# EAGLE design DigiPot (EAGLE 5.11)
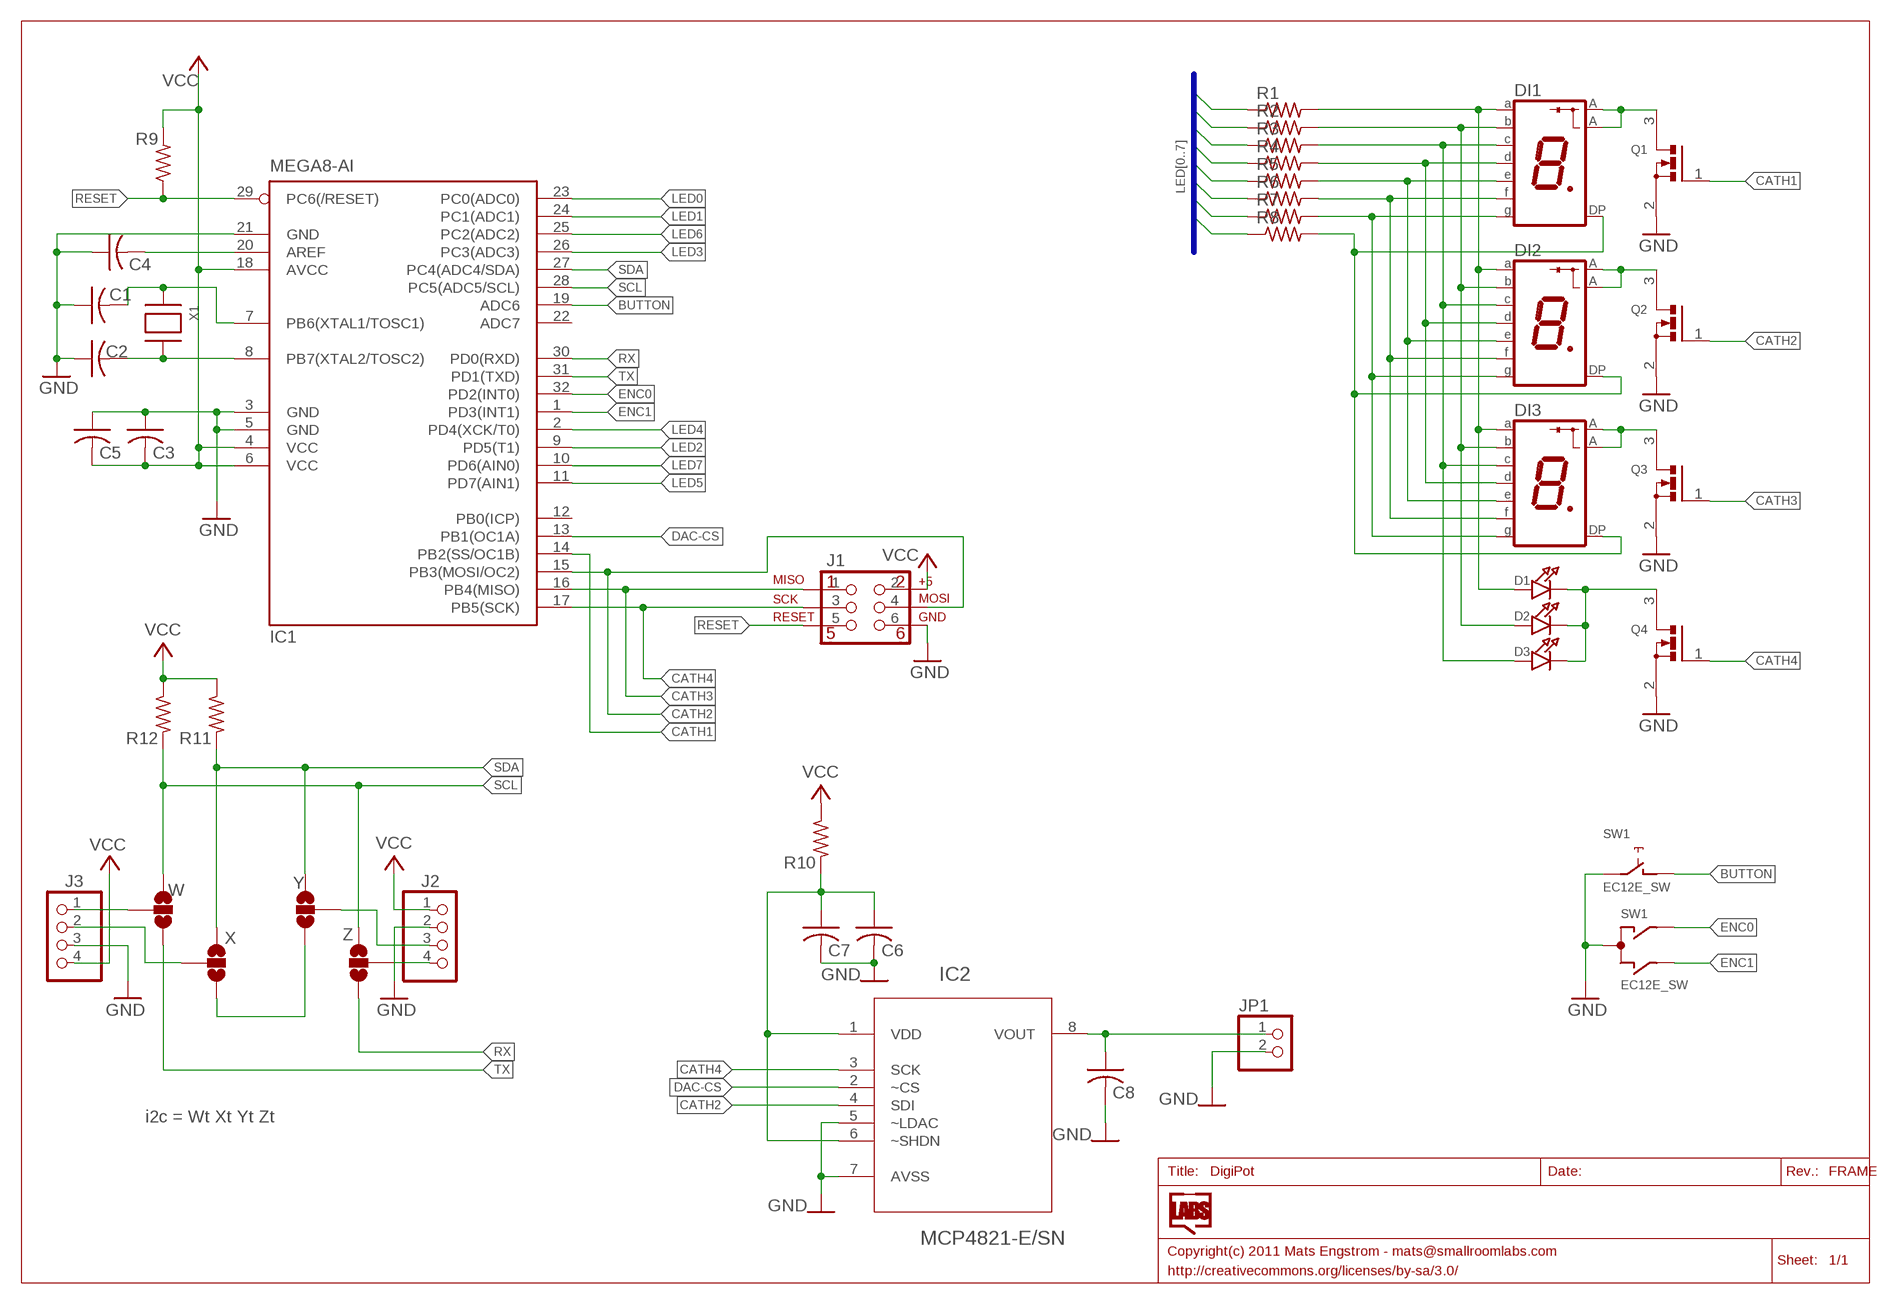
[diagram p0: schematic, sheet 1]

## Parts
C1  C-USC0805K  [C0805K]
C2  C-USC0805K  [C0805K]
C3  C-USC0805K  [C0805K]
C4  C-USC0805K  [C0805K]
C5  C-USC0805K  [C0805K]
C6  C-USC0805K  [C0805K]
C7  C-USC0805K  [C0805K]
C8  C-USC0805K  [C0805K]
D1  LEDSMD0805  [CHIPLED_0805]
D2  LEDSMD0805  [CHIPLED_0805]
D3  LEDSMD0805  [CHIPLED_0805]
DI1  7SEG-CA0.3"SMD  [KCSA03]
DI2  7SEG-CA0.3"SMD  [KCSA03]
DI3  7SEG-CA0.3"SMD  [KCSA03]
IC1  MEGA8-AI  [TQFP32-08]
IC2  MCP4821-E/SN  [SOIC8-N_MC]
J1  AVR-ISP6_EDGE  [ISP-EDGE]
J2  HEADER1X0490OCT  [1X04/90_OCT]
J3  HEADER1X0490OCT  [1X04/90_OCT]
JP1  PINHD-1X2/90  [1X02/90]
Q1  MOSFET-NWAVE  [SOT23-W]
Q2  MOSFET-NWAVE  [SOT23-W]
Q3  MOSFET-NWAVE  [SOT23-W]
Q4  MOSFET-NWAVE  [SOT23-W]
R1  RES0805A  [R0805A]
R2  RES0805A  [R0805A]
R3  RES0805A  [R0805A]
R4  RES0805A  [R0805A]
R5  RES0805A  [R0805A]
R6  RES0805A  [R0805A]
R7  RES0805A  [R0805A]
R8  RES0805A  [R0805A]
R9  RES0805A  [R0805A]
R10  RES0805A  [R0805A]
R11  RES0805A  [R0805A]
R12  RES0805A  [R0805A]
SW1  EC12E_SW  [ALPS_EC12E_SW]
W  SOLDERJUMPER_2WAYS  [SJ_3]
X  SOLDERJUMPER_2WAYS  [SJ_3]
X1  XTALNX5032  [NX5032]
Y  SOLDERJUMPER_2WAYS  [SJ_3]
Z  SOLDERJUMPER_2WAYS  [SJ_3]

## Nets
BUTTON: IC1.19(ADC6) SW1.D
CA1: DI1.P$3(A) DI1.P$8(A) Q1.3(D)
CA2: DI2.P$3(A) DI2.P$8(A) Q2.3(D)
CA3: DI3.P$3(A) DI3.P$8(A) Q3.3(D)
CA4: D1.C D2.C D3.C Q4.3(D)
CATH1: IC1.14(PB2(SS/OC1B)) Q1.1(G)
CATH2: IC1.15(PB3(MOSI/OC2)) IC2.4(SDI) J1.4(MOSI) Q2.1(G)
CATH3: IC1.16(PB4(MISO)) J1.1(MISO) Q3.1(G)
CATH4: IC1.17(PB5(SCK)) IC2.3(SCK) J1.3(SCK) Q4.1(G)
DAC-CS: IC1.13(PB1(OC1A)) IC2.2(~CS)
ENC0: IC1.32(PD2(INT0)) SW1.A
ENC1: IC1.1(PD3(INT1)) SW1.B
GND: C1.1 C2.1 C3.1 C4.1 C5.1 C6.2 C7.2 C8.2 IC1.3(GND) IC1.5(GND) IC1.21(GND) IC2.5(~LDAC) IC2.7(AVSS) J1.6(GND) J2.2 J3.3 JP1.2 Q1.2(S) Q2.2(S) Q3.2(S) Q4.2(S) SW1.C SW1.E
LED0: IC1.23(PC0(ADC0)) R1.1
LED1: IC1.24(PC1(ADC1)) R2.1
LED2: IC1.9(PD5(T1)) R3.1
LED3: IC1.26(PC3(ADC3)) R4.1
LED4: IC1.2(PD4(XCK/T0)) R5.1
LED5: IC1.11(PD7(AIN1)) R6.1
LED6: IC1.25(PC2(ADC2)) R7.1
LED7: IC1.10(PD6(AIN0)) R8.1
LEDA: D1.A DI1.P$7(A) DI2.P$7(A) DI3.P$7(A) R1.2
LEDB: D2.A DI1.P$6(B) DI2.P$6(B) DI3.P$6(B) R2.2
LEDC: D3.A DI1.P$4(C) DI2.P$4(C) DI3.P$4(C) R3.2
LEDD: DI1.P$2(D) DI2.P$2(D) DI3.P$2(D) R4.2
LEDE: DI1.P$1(E) DI2.P$1(E) DI3.P$1(E) R5.2
LEDF: DI1.P$9(F) DI2.P$9(F) DI3.P$9(F) R6.2
LEDG: DI1.P$10(G) DI2.P$10(G) DI3.P$10(G) R7.2
LEDP: DI1.P$5(DP) DI2.P$5(DP) DI3.P$5(DP) R8.2
LEFT-A: J3.1 W.2
LEFT-B: J3.2 X.2
N$1: X.3 Y.1
N$2: C8.1 IC2.8(VOUT) JP1.1
N$3: C6.1 C7.1 IC2.1(VDD) IC2.6(~SHDN) R10.2
N$4: C1.2 IC1.7(PB6(XTAL1/TOSC1)) X1.P$1
N$5: C4.2 IC1.20(AREF)
N$7: C2.2 IC1.8(PB7(XTAL2/TOSC2)) X1.P$2
RESET: IC1.29(PC6(/RESET)) J1.5(RESET) R9.1
RIGHT-A: J2.4 Z.2
RIGHT-B: J2.3 Y.2
RX: IC1.30(PD0(RXD)) Z.1
SCL: IC1.28(PC5(ADC5/SCL)) R12.2 W.1 Z.3
SDA: IC1.27(PC4(ADC4/SDA)) R11.2 X.1 Y.3
TX: IC1.31(PD1(TXD)) W.3
VCC: C3.2 C5.2 IC1.4(VCC) IC1.6(VCC) IC1.18(AVCC) J1.2(V+) J2.1 J3.4 R9.2 R10.1 R11.1 R12.1
Unconnected: IC1.12(PB0(ICP)) IC1.22(ADC7) SW1.GND1(G) SW1.GND2(G)

## Buses
LED[0..7]

## Notes on the sheet
- i2c = Wt Xt Yt Zt

## Library data of the parts
C1-C8 = resistor:C-US: CAPACITOR, American symbol
D1-D3 = SmallRoomLabs:LED
DI1-DI3 = SmallRoomLabs:7SEG-CA
IC1 = atmel:MEGA8: MICROCONTROLLER 8 Kbytes FLASH, 1 kbytes SRAM, 512 bytes EEPROM, USART, 6-channel 10 bit ADC, 2-channel 8 bit ADC Pin compatible with Atmega48, ATMega88, ATMega168 Source: avr.lbr; MPN: ATMEGA8-16AU; OC_FARNELL: 9171371; OC_NEWARK: 73M8863
IC2 = SmallRoomLabs:MCP4821-E/SN: 12 Bit DAC; DESCRIPTION: 12 Bit DAC; MPN: MCP4821-E/SN; OC_FARNELL: 1439412; OC_NEWARK: 31K2970; PACKAGE: SOIC-8; SUPPLIER: Microchip
J1 = SmallRoomLabs:AVR-ISP6
J2 J3 = SmallRoomLabs:HEADER1X04
JP1 = pinhead:PINHD-1X2: PIN HEADER
Q1-Q4 = microbuilder:MOSFET-N: N-Channel Mosfet Digikey: 2N7002ET1GOSTR-ND
R1-R12 = SmallRoomLabs:RES
SW1 = switch-alps:EC12E_SW: ALPS rotary Encoder EC12E series with switch; MPN: EC12E2424407; OC_FARNELL: 1520813; OC_NEWARK: 74M1068
W X Y Z = SparkFun:SOLDERJUMPER_2WAY: Solder Jumper 2 way solder jumper
X1 = adafruit:XTAL: Low cost SMT crystals, no capacitors included http://www.ladyada.net/library/eagle

## Net classes
0 default: width 0.203 mm, clearance 0.203 mm

## Board
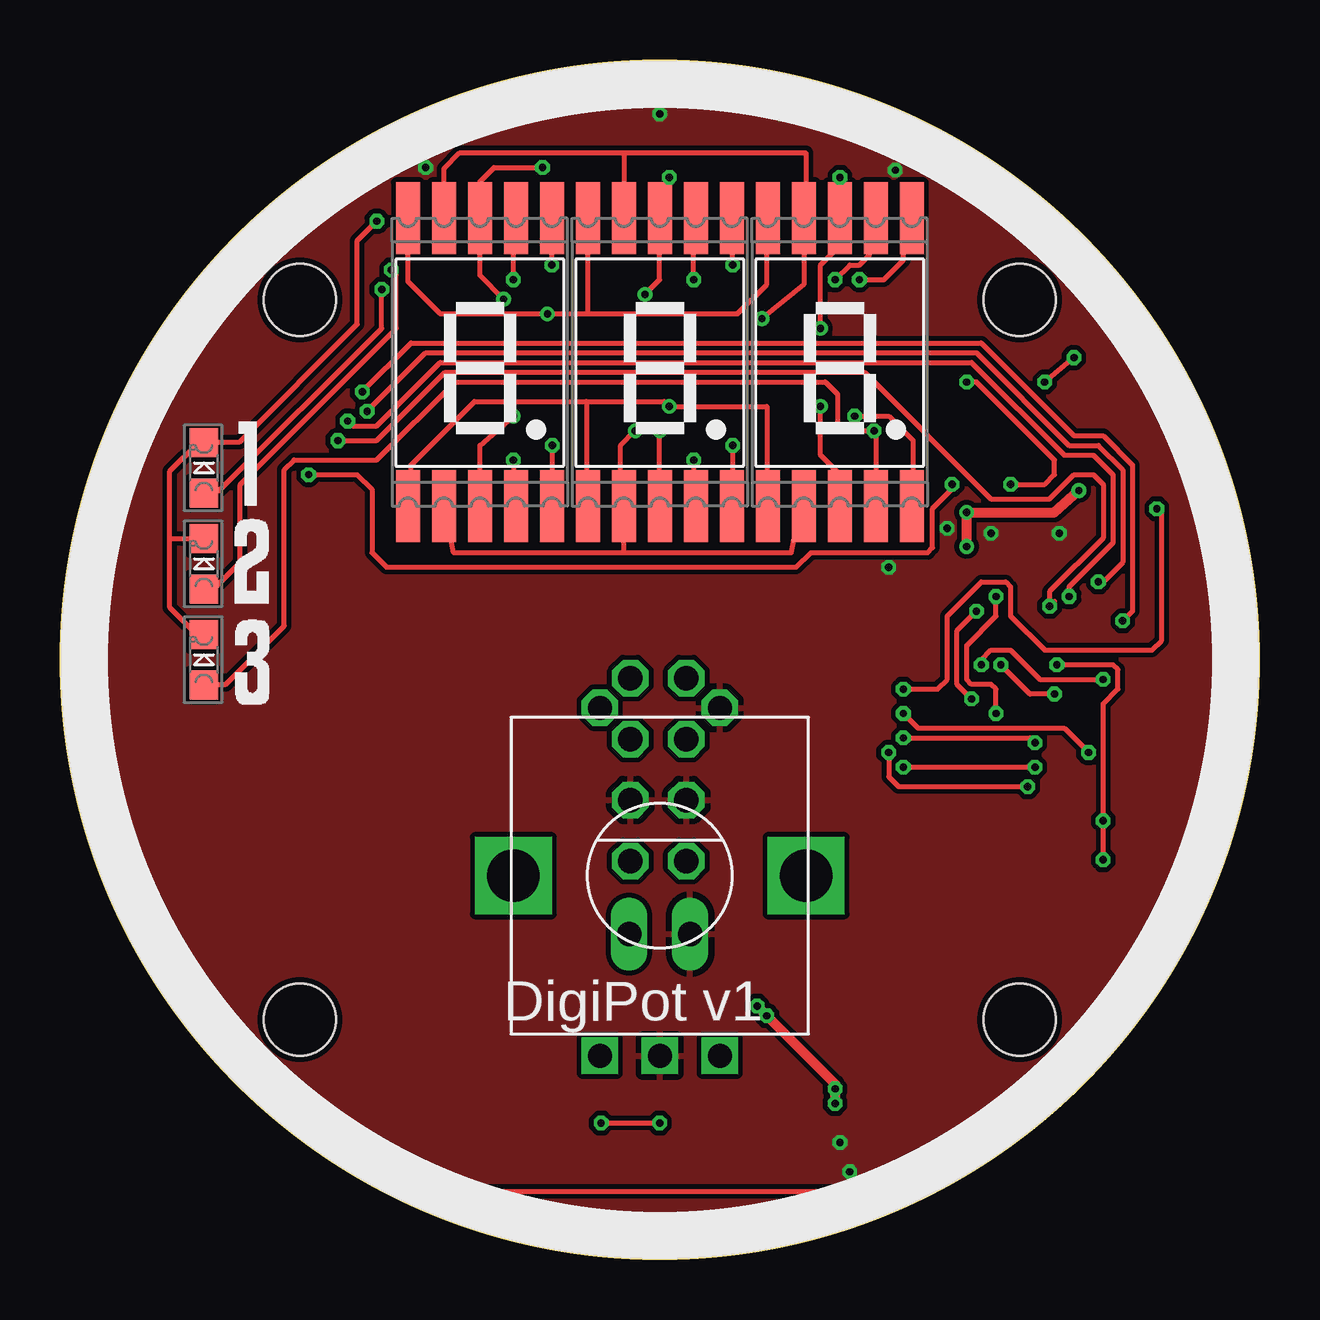
[diagram p1: board, top side]
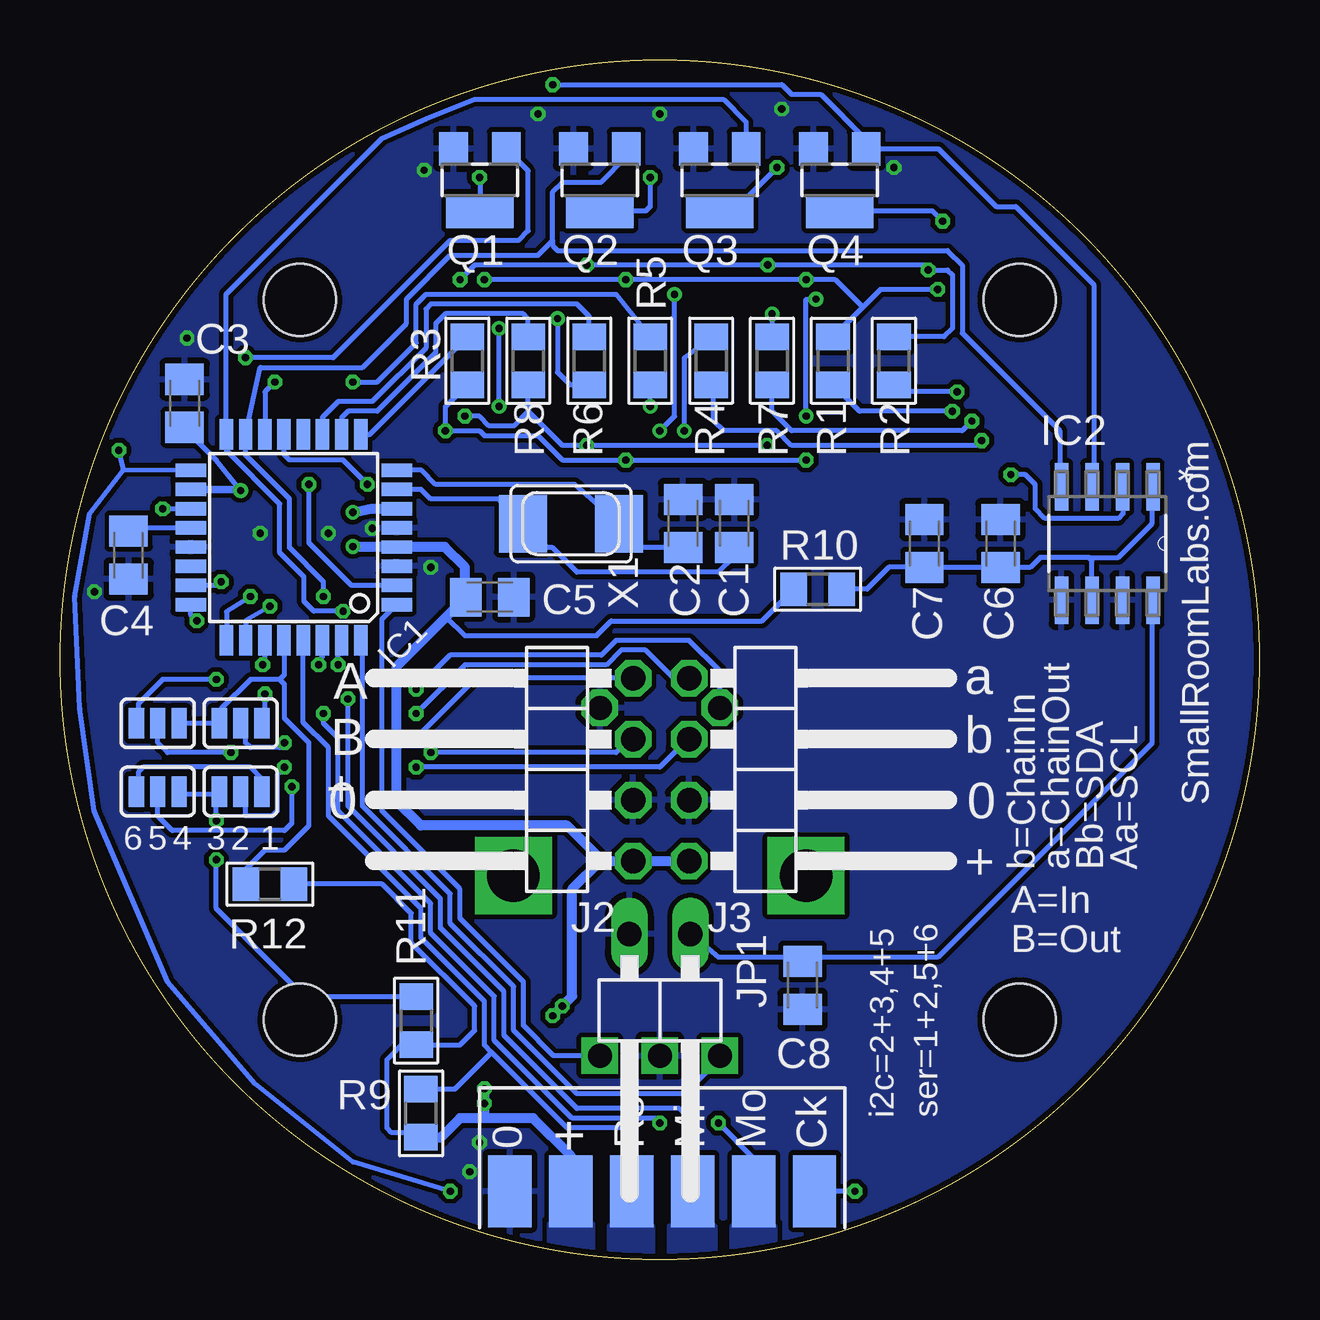
[diagram p2: board, bottom side, seen from below]

Size 50 x 50 mm. Coordinates in mm from the lower left corner, seen from the top.
Outline: circle at 25,25 radius 25
Copper layers (1*16): Top 0.035mm / dielectric 1.5mm / Bottom 0.035mm
Design rules "Fusion_eagle_rule_v1.1": minimum track width 6mil, minimum drill 12mil, track to track 6mil, track to pad 6mil, pad to pad 6mil, via to via 6mil, smd to smd 0mil, copper to edge 10mil, drill to drill 10mil, minimum pad ring 10mil, minimum via ring 6mil, stop-mask expansion 2mil, vias tented up to drill 100mil, thermal gap 10mil
Holes 3 mm at 10,40 40,40 40,10 10,10

### Footprints (pad centres in the part's own frame; a part is rotated, then mirrored left to right if it is on the bottom)
C0805K = smd 1.3 x 1.6: 1 -1,0; 2 1,0
CHIPLED_0805 = smd 1.2 x 1.2: A 0,-1.05; C 0,1.05
KCSA03 = smd 1 x 3: P$1 -3,-6; P$2 -1.5,-6; P$3 0,-6; P$4 1.5,-6; P$5 3,-6; P$6 3,6; P$7 1.5,6; P$8 0,6; P$9 -1.5,6; P$10 -3,6
TQFP32-08 = smd 1.27 x 0.559: 1 -4.293,2.8; 2 -4.293,2; 3 -4.293,1.2; 4 -4.293,0.4; 5 -4.293,-0.4; 6 -4.293,-1.2; 7 -4.293,-2; 8 -4.293,-2.8; 17 4.293,-2.8; 18 4.293,-2; 19 4.293,-1.2; 20 4.293,-0.4; 21 4.293,0.4; 22 4.293,1.2; 23 4.293,2; 24 4.293,2.8 | smd 0.559 x 1.27: 9 -2.8,-4.293; 10 -2,-4.293; 11 -1.2,-4.293; 12 -0.4,-4.293; 13 0.4,-4.293; 14 1.2,-4.293; 15 2,-4.293; 16 2.8,-4.293; 25 2.8,4.293; 26 2,4.293; 27 1.2,4.293; 28 0.4,4.293; 29 -0.4,4.293; 30 -1.2,4.293; 31 -2,4.293; 32 -2.8,4.293
SOIC8-N_MC = smd 1.981 x 0.559: 1 -2.362,1.905; 2 -2.362,0.635; 3 -2.362,-0.635; 4 -2.362,-1.905; 5 2.362,-1.905; 6 2.362,-0.635; 7 2.362,0.635; 8 2.362,1.905
ISP-EDGE = smd 1.8 x 3: 1 1.27,0; 2 -3.81,0; 3 6.35,0; 4 3.81,0; 5 -1.27,0; 6 -6.35,0
1X04/90_OCT = drill 1.016 octagon: 1 0,3.81; 2 0,1.27; 3 0,-1.27; 4 0,-3.81
1X02/90 = drill 1.016 long: 1 -1.27,-3.81; 2 1.27,-3.81
SOT23-W = smd 1.2 x 1.4: 1 -1.1,-1.3; 2 1.1,-1.3 | smd 2.8 x 1.4: 3 0,1.3
R0805A = smd 1.1 x 1.4: 1 -1,0; 2 1,0
ALPS_EC12E_SW = drill 1 square: A -2.5,-7.5; B 2.5,-7.5; C 0,-7.5 | drill 1 octagon: D -2.5,7; E 2.5,7 | drill 2.2 square: GND1 -6.1,0; GND2 6.1,0
SJ_3 = smd 0.635 x 1.27: 1 -0.889,0; 2 0,0; 3 0.889,0
NX5032 = smd 2 x 2.4: P$1 2,0; P$2 -2,0

### Placement (x,y rotation side)
C1  21.89,30.68 270 bottom
C2  24.03,30.68 270 bottom
C3  44.81,35.69 270 bottom
C4  47.14,29.36 90 bottom
C5  32.08,27.61 180 bottom
C6  10.79,29.84 90 bottom
C7  13.97,29.84 90 bottom
C8  19.05,11.43 270 bottom
D1  6,33 0 top
D2  6,29 0 top
D3  6,25 0 top
DI1  32.5,37.4 0 top
DI2  25,37.4 0 top
DI3  17.5,37.4 0 top
IC1  40.26,30.1 180 bottom
IC2  6.35,29.84 270 bottom
J1  24.9,2.85 0 bottom
J2  26.11,20.42 180 bottom
J3  23.77,20.42 0 bottom
JP1  24.99,9.75 180 bottom
Q1  32.5,45 180 bottom
Q2  27.5,45 180 bottom
Q3  22.5,45 180 bottom
Q4  17.5,45 180 bottom
R1  17.78,37.47 90 bottom
R2  15.24,37.47 90 bottom
R3  33.02,37.47 270 bottom
R4  22.86,37.47 90 bottom
R5  25.4,37.47 270 bottom
R6  27.94,37.47 270 bottom
R7  20.32,37.47 90 bottom
R8  30.48,37.47 270 bottom
R9  34.95,6.1 270 bottom
R10  18.41,27.94 0 bottom
R11  35.15,9.96 90 bottom
R12  41.25,15.65 180 bottom
SW1  25,16 0 top
W  45.92,22.35 180 bottom
X  42.47,19.51 0 bottom
X1  28.7,30.67 180 bottom
Y  45.92,19.51 0 bottom
Z  42.47,22.35 180 bottom

### Tracks (layer width: path | path; a pad name or v marks a point on that pad's centre or on a via)
BUTTON  (via drill 0.3)
  Top 0.203: v35.15,23.77 36.58,23.77 36.98,24.18 36.98,26.82 38.41,28.25 39.42,28.25 39.62,28.04 39.62,26.82 41.05,25.4 45.52,25.4 45.92,25.81 45.92,31.09 v45.72,31.29
  Bottom 0.203: SW1.D 22.5,24.53 23.77,25.81 26.82,25.81 27.43,25.2 33.73,25.2 v35.15,23.77 | v45.72,31.29 IC1.19
CA1  (via drill 0.3)
  Top 0.203: v32.51,45.11 32.51,43.4 DI1.P$8 32.51,43.39 32.51,42.27 31.7,41.45 v31.7,38.81 | DI1.P$3 32.5,32.73 31.7,33.53 v31.7,35.56
  Bottom 0.203: v32.51,45.11 v32.5,45.11 Q1.3 | v31.7,35.56 v31.7,38.81
CA2  (via drill 0.3)
  Top 0.203: v25.4,45.11 25.41,43.48 DI2.P$8 24.99,40.84 v24.38,40.23 | DI2.P$3 v24.99,34.54
  Bottom 0.203: v24.99,34.54 24.38,35.15 v24.38,40.23 | Q2.3 25.59,43.7 25.4,43.89 v25.4,45.11
CA3  (via drill 0.3)
  Top 0.203: DI3.P$3 17.5,33.93 v18.9,35.15 | v18.49,40.03 17.5,41.02 DI3.P$8 17.5,44.93 18.09,45.52 v20.12,45.52
  Bottom 0.203: 22.35,43.69 Q3.3 21.93,43.7 v20.12,45.52 | v18.9,35.15 18.9,40.03 v18.49,40.03
CA4  (via drill 0.3)
  Top 0.203: v13.21,43.28 12.39,42.47 12.39,38.99 7.48,34.08 6.03,34.08 D1.C 5.77,34.05 4.58,32.86 4.58,30.07 | 4.58,30.07 4.58,27.17 5.6,26.15 5.9,26.15 D3.C | D2.C 4.6,30.05 4.58,30.07
  Bottom 0.203: v13.21,43.28 13.63,43.7 Q4.3
CATH1  (via drill 0.3)
  Top 0.203: v42.27,37.59 v41.05,36.58
  Bottom 0.203: Q1.1 30.48,45.38 30.48,42.88 30.89,42.47 33.73,42.47 38.61,37.59 v42.27,37.59 | v41.05,36.58 41.45,36.17 IC1.14
CATH2  (via drill 0.3)
  Top 0.203: v39.01,27.64 39.01,26.82 37.8,25.6 37.8,24.18 38,23.98 38.81,23.98 39.01,23.77 v39.01,22.76 | v22.55,5.69 v24.99,5.69
  Bottom 0.203: IC1.15 | Q2.1 26.4,45.94 27.43,44.91 29.06,44.91 29.46,44.5 29.46,42.47 | 29.46,42.47 30.07,41.86 33.73,41.86 35.56,40.03 35.56,39.01 37.39,37.19 41.66,37.19 IC1.15 | v22.55,5.69 21.09,4.22 J1.4 | v39.01,27.64 39.01,28.25 40.44,29.67 40.44,31.7 42.27,33.53 IC1.15 | v39.01,22.76 39.01,22.35 38.41,21.74 38.41,18.69 34.54,14.83 34.54,13.61 31.9,10.97 31.9,9.14 28.65,5.89 25.2,5.89 v24.99,5.69 | 29.46,42.47 29.46,42.27 29.26,42.06 13.01,42.06 12.39,41.45 12.39,38.61 8.33,34.54 8.33,32.28 IC2.4
  pour Bottom (rank 2, no thermals): 20.2,1.4 20.2,0.4 22,0.4 22,1.4
CATH3  (via drill 0.3)
  Top 0.203: v38,23.37 37.39,23.98 37.39,26.21 v38.2,27.03
  Bottom 0.203: v38,23.37 38,18.9 34.14,15.04 34.14,13.82 31.5,11.18 31.5,9.35 28.45,6.3 24.18,6.3 23.77,5.89 23.77,3 J1.1 | Q3.1 21.4,47.41 22.35,48.36 32.72,48.36 34.75,47.55 36.58,46.74 43.08,40.23 43.08,34.41 IC1.16 43.06,33.71 40.84,31.5 40.84,29.46 39.83,28.45 39.83,27.43 39.42,27.03 v38.2,27.03
  pour Bottom (rank 2, no thermals): 22.7,1.4 22.7,0.1 24.6,0.1 24.6,1.4
CATH4  (via drill 0.3)
  Top 0.203: v29.46,48.97 33.33,48.16 36.58,46.74 38.81,45.31 42.06,42.67 44.91,39.42 46.13,37.59 47.55,34.75 v47.55,33.73 | v16.87,2.85 v33.73,2.85
  Bottom 0.203: 47.35,32.92 48.77,31.09 49.38,27.64 49.17,22.96 48.56,18.69 45.52,11.58 41.86,7.32 37.8,4.06 v33.73,2.85 | 47.35,32.92 IC1.17 | v29.46,48.97 19.91,48.97 19.51,48.56 18.29,48.56 16.4,46.68 Q4.1 13.38,46.3 10.97,43.89 10.16,43.89 6.91,40.64 6.91,32.28 IC2.3 | 47.35,32.92 v47.55,33.73 | v16.87,2.85 J1.3
DAC-CS  (via drill 0.3)
  Top 0.203: v37.19,32.31 37.19,32.11 36.37,31.29 36.37,29.67 36.17,29.46 31.29,29.46 30.68,28.85 13.61,28.85 13.01,29.46 13.01,32.11 12.39,32.72 v10.36,32.72
  Bottom 0.203: IC1.13 40.66,33.55 40.44,33.33 38.2,33.33 v37.19,32.31 | v10.36,32.72 9.75,32.72 9.35,32.31 9.35,31.29 8.94,30.89 5.89,30.89 5.69,31.09 5.69,32.18 IC2.2
ENC0
  Bottom 0.203: SW1.A 22.5,8.39 23.98,6.91 28.45,6.91 31.09,9.55 31.09,11.38 33.73,14.02 33.73,15.24 37.39,18.9 37.39,25.74 IC1.32
ENC1
  Bottom 0.203: SW1.B 29.43,8.5 30.68,9.75 30.68,11.58 33.33,14.22 33.33,15.44 36.58,18.69 36.58,26.69 IC1.1
GND  (via drill 0.3)
  other vias: 48.56,27.84 44.7,38.4 36.98,30.48 34.54,28.85 30.07,47.75 24.99,47.75 19.91,47.96 34.82,45.41 15.24,45.52 32.51,4.88 32.92,3.66 38.81,30.28 41.66,30.28
  pour Bottom (rank 5): 0,25 arc-90 25,50 arc-90 50,25 arc-90 25,0 arc-90
  pour Top: 0,25 arc-90 25,50 arc-90 50,25 arc-90 25,0 arc-90
LED0  (via drill 0.3)
  Top 0.203: v43.28,28.25 43.48,28.25 44.3,29.06 44.3,32.92 43.28,33.93 42.06,33.93 38.2,37.8 15.24,37.8 v12.8,35.36
  Bottom 0.203: 17.68,36.36 R1.1 16.67,35.36 v12.8,35.36 | IC1.23 43.43,28.1 v43.28,28.25
LED1  (via drill 0.3)
  Top 0.203: v12.6,36.17 14.63,38.2 38.41,38.2 42.27,34.34 43.48,34.34 44.7,33.12 44.7,27.03 v44.3,26.62
  Bottom 0.203: IC1.24 44.55,26.87 v44.3,26.62 | v12.6,36.17 14.95,36.17 R2.1
LED2
  Bottom 0.203: IC1.9 37.09,34.39 R3.1
LED3  (via drill 0.3)
  Top 0.203: 41.45,27.43 v41.25,27.23 41.25,27.84 43.48,30.07 43.48,32.31 43.08,32.72 42.27,32.72 41.25,31.7 38.81,31.7 33.53,36.98 16.05,36.98 13.21,34.14 v11.58,34.14
  Bottom 0.203: R4.1 22.76,36.36 22.76,34.95 22.35,34.54 20.12,34.54 19.51,33.93 11.79,33.93 v11.58,34.14 | IC1.26 42.26,26.63 v41.25,27.23
LED4  (via drill 0.3)
  Top 0.203: v37.8,36.58 38.2,36.58 41.45,33.33 41.45,32.72 41.05,32.31 v39.62,32.31
  Bottom 0.203: R5.1 26.82,40.23 34.75,40.23 35.15,39.83 35.15,38.2 36.78,36.58 v37.8,36.58 | IC1.2 37.85,28.1 39.62,29.87 v39.62,32.31
LED5
  Bottom 0.203: R6.1 27.94,39.32 28.45,39.83 34.54,39.83 34.75,39.62 34.75,38 36.98,35.76 38.41,35.76 39.06,35.11 IC1.11
LED6  (via drill 0.3)
  Top 0.203: v42.06,27.64 42.06,28.04 43.89,29.87 43.89,32.72 43.08,33.53 41.86,33.53 38,37.39 15.85,37.39 13.21,34.75 12.19,34.75 v11.99,34.95
  Bottom 0.203: R7.1 20.32,35.36 19.51,34.54 12.39,34.54 v11.99,34.95 | IC1.25 43.06,27.01 v42.06,27.64
LED7
  Bottom 0.203: R8.1 30.48,39.22 30.68,39.42 33.93,39.42 34.34,39.01 34.34,37.8 36.78,35.36 38,35.36 38.26,35.1 IC1.10
LEDA  (via drill 0.3)
  Top 0.203: DI3.P$7 18.9,43.4 v18.9,40.84 | DI2.P$7 26.42,43.4 v26.42,40.84 | v32.31,40.84 32.92,41.45 33.33,41.45 33.73,41.86 33.73,43.13 DI1.P$7 | v13.41,40.44 13.41,38.81 6.64,32.04 6.09,32.04 D1.A
  Bottom 0.203: v32.31,40.84 v26.42,40.84 v18.9,40.84 17.68,40.84 16.54,39.7 | v13.41,40.44 15.81,40.44 16.54,39.7 | 16.54,39.7 R1.2
LEDB  (via drill 0.3)
  Top 0.203: DI2.P$6 28.04,43.4 v28.04,41.45 | 35.56,43.4 DI1.P$6 35.5,43.22 35.15,42.88 35.15,41.66 34.34,40.84 v33.33,40.84 | v20.5,41.45 DI3.P$6 | D2.A 6.41,27.95 7.52,29.06 7.52,32.31 14.02,38.81 14.02,41.05 v13.82,41.25
  Bottom 0.203: R2.2 13.15,38.47 12.8,38.81 12.8,41.05 13.01,41.25 v13.82,41.25 14.02,41.45 v20.5,41.45 v28.04,41.45 32.72,41.45 v33.33,40.84
LEDC  (via drill 0.3)
  Top 0.203: DI3.P$4 18.9,31.4 v18.9,33.33 | DI2.P$4 26.42,31.4 v26.42,33.33 | DI1.P$4 34,34.48 v33.93,34.54 32.61,34.54 32.41,34.75 32.41,36.07 31.9,36.58 16.46,36.58 13.21,33.33 9.75,33.33 9.35,32.92 9.35,26.42 6.91,23.98 6.03,23.98 D3.A
  Bottom 0.203: v18.9,33.33 v26.42,33.33 29.06,33.33 30.07,34.34 32.31,34.34 32.51,34.54 v33.93,34.54 33.93,35.55 R3.2
LEDD  (via drill 0.3)
  Top 0.203: DI3.P$2 16.41,29.46 23.5,29.46 | 23.5,29.46 30.48,29.46 30.89,31.4 DI1.P$2 | 23.5,29.46 DI2.P$2 23.5,31.9 23.37,31.9 23.37,33.93 v23.98,34.54
  Bottom 0.203: R4.2 22.86,38.41 23.98,37.59 v23.98,34.54
LEDE  (via drill 0.3)
  Top 0.203: DI1.P$1 29.46,31.4 29.46,35.56 v25.4,35.56 25.2,35.76 21.95,35.76 | DI3.P$1 14.63,31.4 14.63,33.12 17.27,35.76 21.95,35.76 | DI2.P$1 21.95,31.4 21.95,35.76
  Bottom 0.203: v25.4,35.56 R5.2
LEDF  (via drill 0.3)
  Top 0.203: 23.5,46.13 DI2.P$9 | 23.5,46.13 31.09,46.13 31.09,43.4 DI1.P$9 31,40.64 v29.26,39.22 | DI3.P$9 16,45.46 16.66,46.13 23.5,46.13
  Bottom 0.203: R6.2 28.74,36.47 29.26,36.98 v29.26,39.22
LEDG  (via drill 0.3)
  Top 0.203: DI1.P$10 29.46,43.4 29.46,40.64 28.25,39.42 22,39.42 | 22,39.42 v20.32,39.42 15.85,39.42 14.5,40.77 DI3.P$10 | 22,39.42 DI2.P$10
  Bottom 0.203: v20.32,39.42 R7.2
LEDP  (via drill 0.3)
  Top 0.203: DI3.P$5 20.52,31.4 v20.52,33.93 | DI2.P$5 28.04,31.4 v28.04,33.93 | v33.12,35.15 34.54,35.15 35.56,34.14 35.56,31.46 DI1.P$5
  Bottom 0.203: v20.52,33.93 v28.04,33.93 29.06,33.93 30.48,35.36 | 30.48,35.36 R8.2 | v33.12,35.15 32.51,35.15 32.11,34.75 31.09,34.75 30.48,35.36
LEFT-A  (via drill 0.3)
  Top 0.203: v35.15,22.76 35.76,22.15 41.86,22.15 v42.88,21.13
  Bottom 0.203: J3.1 24.43,24.23 25.6,25.4 26.62,25.4 27.23,24.79 33.12,24.79 v35.15,22.76 | v42.88,21.13 45.52,21.13 45.92,21.54 W.2
LEFT-B  (via drill 0.3)
  Top 0.203: v35.15,20.52 v40.64,20.52
  Bottom 0.203: J3.2 23.82,21.69 24.99,20.52 v35.15,20.52 | v40.64,20.52 40.95,20.22 40.95,18.69 41.15,18.49 42.27,18.49 42.27,19.3 X.2
N$1
  Bottom 0.203: X.3 41.58,20.04 42.06,20.52 46.53,20.52 46.74,20.32 46.74,19.58 Y.1
N$2
  Bottom 0.203: 19.22,12.6 C8.1 | 19.22,12.6 22.55,12.6 JP1.1 | 19.22,12.6 13.41,12.6 4.47,21.54 4.47,27.46 IC2.8
N$3
  Bottom 0.203: R10.2 16.36,27.94 15.44,28.85 13.98,28.85 C7.1 C6.1 9.56,28.84 9.14,29.26 7.11,29.26 | IC2.1 4.47,32.18 4.47,30.68 5.89,29.26 7.11,29.26 | IC2.6 6.99,29.13 7.11,29.26
N$4
  Bottom 0.203: IC1.7 34.94,32.1 34.54,31.7 31.73,31.7 X1.P$1 29.7,29.67 29.46,29.67 28.45,28.65 22.55,28.65 21.89,29.31 C1.2
N$5
  Bottom 0.203: IC1.20 46.43,30.5 C4.2
N$7
  Bottom 0.203: 35.95,32.92 IC1.8 34.93,32.9 34.34,32.31 28.55,32.31 X1.P$2 25.72,29.68 C2.2
RESET
  Bottom 0.203: IC1.29 39.86,22.38 38.81,21.34 38.81,18.49 34.95,14.63 34.95,13.41 32.31,10.77 32.31,8.94 32,8.64 | J1.5 26.17,5.24 26.42,5.49 28.85,5.49 32,8.64 | R9.1 33.54,7.1 32,8.64
  pour Bottom (rank 2, no thermals): 25.3,1.4 25.3,-0.1 27.1,-0.1 27.1,1.4
RIGHT-A  (via drill 0.3)
  Top 0.203: v35.15,21.74 40.44,21.74 v40.64,21.54
  Bottom 0.203: J2.4 32.66,24.23 v35.15,21.74 | Z.2 42.27,22.35 42.27,21.54 42.06,21.34 40.84,21.34 v40.64,21.54
RIGHT-B  (via drill 0.3)
  Top 0.203: v40.34,19.71 34.95,19.71 34.54,20.12 v34.54,21.13
  Bottom 0.203: J2.3 26.26,21.69 26.82,21.13 v34.54,21.13 | Y.2 45.92,18.49 45.31,17.88 40.64,17.88 40.34,18.19 v40.34,19.71
RX  (via drill 0.3)
  Top 0.203: v41.45,23.57 40.44,23.57 v39.22,24.79
  Bottom 0.203: IC1.30 39.06,25.15 v39.22,24.79 | v41.45,23.57 41.45,22.48 Z.1
SCL
  Bottom 0.203: Z.3 W.1 | Z.3 43.28,22.43 | Z.3 43.28,22.35 43.28,22.96 42.06,24.18 40.84,24.18 | 40.64,25.81 IC1.28 40.64,25.79 40.64,24.38 40.84,24.18 | R12.2 42.25,16.27 41.45,17.07 40.64,17.07 39.62,18.09 39.62,21.54 40.64,22.55 40.64,23.98 40.84,24.18
SDA  (via drill 0.3)
  Top 0.203: v41.55,24.79 43.89,24.79 44.09,24.59 44.09,23.77 43.48,23.16 v43.48,18.29 v43.48,16.66
  Bottom 0.203: v41.55,24.79 41.45,24.99 IC1.27 | v43.48,18.29 43.48,19.38 | 43.48,19.38 X.1 | 43.48,19.38 44.91,19.38 Y.3 | R11.2 39.81,10.96 43.48,14.63 v43.48,16.66
TX  (via drill 0.3)
  Top 0.203: v38.41,24.79 38.41,24.99 38.81,25.4 39.62,25.4 40.84,24.18 v43.48,24.18
  Bottom 0.203: IC1.31 38.26,25.75 38.41,25.6 v38.41,24.79 | v43.48,24.18 45.72,24.18 46.74,23.16 46.74,22.43 W.3
VCC  (via drill 0.3)
  Top 0.406: v37.8,29.72 v37.8,31.14 41.45,31.14 v42.47,32.05 | v29.06,10.57 32.31,7.32 v32.31,7.11 v32.31,6.5
  Bottom 0.203: C3.2 44.81,34.65 43.48,33.33 v42.47,32.05 | R10.1 20.74,26.62 27.03,26.62 27.64,26.01 33.12,26.01 33.9,26.79 | R9.2 35.14,5.28 36.17,5.28 36.37,5.49 36.37,8.33 35.54,9.16 R11.1 35.14,8.94 33.33,8.94 32.72,9.55 32.72,10.57 35.36,13.21 35.36,14.43 36.58,15.65 R12.1
  Bottom 0.305: IC1.18 42.51,32.1 v42.47,32.05
  Bottom 0.406: IC1.6 37.03,31.3 v37.8,31.14 | J3.4 J2.1 27.38,16.61 27.43,16.66 | C5.2 32.92,27.45 | C5.2 33.12,27.65 33.12,28.85 33.97,29.7 IC1.4 37.78,29.7 v37.8,29.72 | 27.43,16.66 28.85,18.09 34.95,18.09 35.97,19.1 35.97,24.72 33.9,26.79 C5.2 | J1.2 28.71,4.32 30.28,5.89 32.31,5.89 | 32.31,5.89 33.33,5.89 34.14,5.08 34.93,5.08 R9.2 | v29.06,10.57 v29.46,10.16 28.65,10.97 28.65,15.44 27.43,16.66 | 32.31,5.89 v32.31,7.11
  pour Bottom (rank 2, no thermals): 27.8,1.5 27.8,0.1 29.6,0.1 29.6,1.5

### Text on the board
tPlace: DigiPot v1
bPlace: SmallRoomLabs.com | a | A | b | B | + | 0 | 0 | 1 | 2 | 3 | 4 | 5 | 6 | Aa=SCL | Bb=SDA | a=ChainOut | b=ChainIn | + | A=In | ser=1+2,5+6 | i2c=2+3,4+5 | B=Out